# Altium schematic sheet mboard_pwr_ctrl.SchDoc: =GlobalProjectName
size 209 x 297 mm; SheetNumber: Лист; SheetTotal: Листов; PageSetup: Record=PageOptions|CenterHorizontal=True|CenterVertical=True|PrintScale=1.00|XCorrection=1.00|YCorrection=1.00|PrintKind=1|BorderSize=5000000|LeftOffset=0|BottomOffset=0|Orientation=2|PaperLength=1000|PaperWidth=1000|Scale=100|PaperSource=15|PrintQuality=1200|MediaType=1|DitherType=10|PaperKind=A3|PrintScaleMode=1; Weight: -; ScaleFactor: -
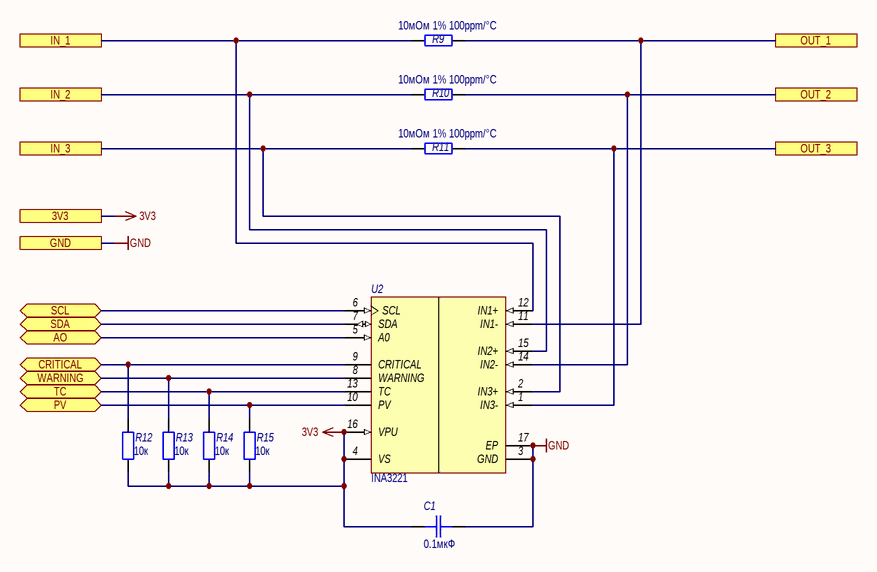
[diagram p0: mboard_pwr_ctrl.SchDoc]

## Parts
C1  0.1мкФ  [SMD_C0603]
R9  10мОм 1% 100ppm/°C  [SMD_0805]
R10  10мОм 1% 100ppm/°C  [SMD_0805]
R11  10мОм 1% 100ppm/°C  [SMD_0805]
R12  10к  [SMD_0603]
R13  10к  [SMD_0603]
R14  10к  [SMD_0603]
R15  10к  [SMD_0603]
U2  INA3221  [VQFN-16]

## Ports
3V3, AO (bidir), CRITICAL (bidir), GND, IN_1, IN_2, IN_3, OUT_1, OUT_2, OUT_3, PV (bidir), SCL (bidir), SDA (bidir), TC (bidir), WARNING (bidir)

## Nets
3V3: C1.2 R12.1 R13.1 R14.1 R15.1 U2.4(VS) U2.16(VPU) ; port 3V3
GND: C1.1 U2.3(GND) U2.17(EP) ; port GND
AO: U2.5(A0) ; port AO
CRITICAL: R12.2 U2.9(CRITICAL) ; port CRITICAL
IN_1: R9.2 U2.12(IN1+) ; port IN_1
IN_2: R10.2 U2.15(IN2+) ; port IN_2
IN_3: R11.2 U2.2(IN3+) ; port IN_3
OUT_1: R9.1 U2.11(IN1-) ; port OUT_1
OUT_2: R10.1 U2.14(IN2-) ; port OUT_2
OUT_3: R11.1 U2.1(IN3-) ; port OUT_3
PV: R15.2 U2.10(PV) ; port PV
SCL: U2.6(SCL) ; port SCL
SDA: U2.7(SDA) ; port SDA
TC: R14.2 U2.13(TC) ; port TC
WARNING: R13.2 U2.8(WARNING) ; port WARNING

## Notes on the sheet
- Подп. и дата
- Инв. № дубл.
- Взам. инв. №
- Инв. № подл.
- Изм.
- Лист
- № докум.
- Подп.
- Дата
- Форма 2а ГОСТ 2.104-2006
- Копировал
- Формат А4

## Library data of the parts
C1 = Capacitor: Назначение: SMD-конденсатор; Наименование: Конденсатор; Потребление, Вт: 0; Value: 0.1мкФ
R9-R11 = Resistor: PE1206DRM470R01L; Наименование: Резистор; Назначение: SMD-резистор; Потребление, Вт: 0,001; Value: 10мОм 1% 100ppm/°C
R12-R15 = Resistor: Наименование: Резистор; Назначение: SMD-резистор; Потребление, Вт: 0,001; Value: 10к
U2 = INA3221: Triple-Channel, High-Side Measurement, / Shunt and Bus Voltage Monitor with I2C- and SMBUS-Compatible Interface; Потребление, Вт: 0.001; ComponentLink1Description: Data sheet; ComponentLink1URL: https://www.ti.com/lit/ds/symlink/ina3221.pdf?ts=1635579800802&ref_url=https%253A%252F%252Fwww.ti.com%252Fproduct%252FINA3221; Назначение: Triple-Channel, High-Side Measurement,; Supplier Part Number 1: INA3221AIRGVT; Наименование: INA3221